# EAGLE design receiver (EAGLE 6.4)
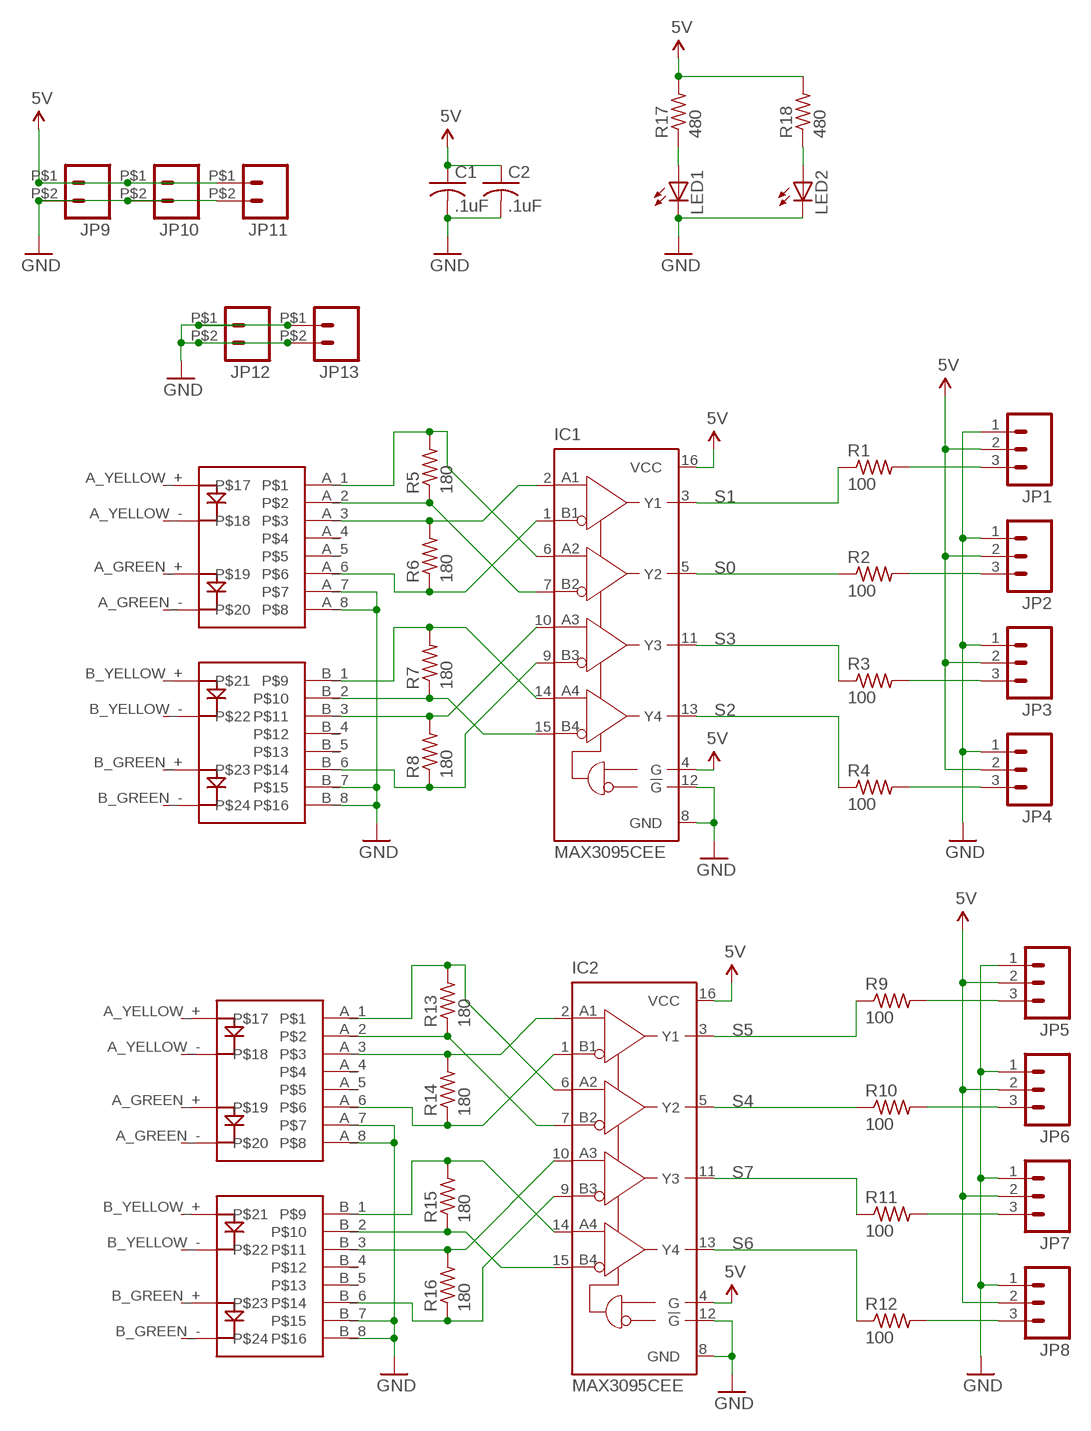
[diagram p0: schematic, sheet 1]

## Parts
C1  .1uF  C-USC0603  [C0603]
C2  .1uF  C-USC0603  [C0603]
IC1  MAX3095CEE  [QSOP16]
IC2  MAX3095CEE  [QSOP16]
JP1  M03-SCREW-5MM  [SCREWTERMINAL-5MM-3]
JP2  M03-SCREW-5MM  [SCREWTERMINAL-5MM-3]
JP3  M03-SCREW-5MM  [SCREWTERMINAL-5MM-3]
JP4  M03-SCREW-5MM  [SCREWTERMINAL-5MM-3]
JP5  M03-SCREW-5MM  [SCREWTERMINAL-5MM-3]
JP6  M03-SCREW-5MM  [SCREWTERMINAL-5MM-3]
JP7  M03-SCREW-5MM  [SCREWTERMINAL-5MM-3]
JP8  M03-SCREW-5MM  [SCREWTERMINAL-5MM-3]
JP9  M026.35MM  [SCREWTERMINAL-6.35MM-2]
JP10  M026.35MM  [SCREWTERMINAL-6.35MM-2]
JP11  M026.35MM  [SCREWTERMINAL-6.35MM-2]
JP12  M026.35MM  [SCREWTERMINAL-6.35MM-2]
JP13  M026.35MM  [SCREWTERMINAL-6.35MM-2]
LED1  LEDCHIPLED_0805  [CHIPLED_0805]
LED2  LEDCHIPLED_0805  [CHIPLED_0805]
R1  100  R-US_R0603  [R0603]
R2  100  R-US_R0603  [R0603]
R3  100  R-US_R0603  [R0603]
R4  100  R-US_R0603  [R0603]
R5  180  R-US_R0603  [R0603]
R6  180  R-US_R0603  [R0603]
R7  180  R-US_R0603  [R0603]
R8  180  R-US_R0603  [R0603]
R9  100  R-US_R0603  [R0603]
R10  100  R-US_R0603  [R0603]
R11  100  R-US_R0603  [R0603]
R12  100  R-US_R0603  [R0603]
R13  180  R-US_R0603  [R0603]
R14  180  R-US_R0603  [R0603]
R15  180  R-US_R0603  [R0603]
R16  180  R-US_R0603  [R0603]
R17  480  R-US_R0603  [R0603]
R18  480  R-US_R0603  [R0603]
U$1  RJ45_2X1  [RJ45_2X1]
U$2  RJ45_2X1  [RJ45_2X1]

## Nets
5V: C1.1 C2.1 IC1.4(G) IC1.16(VCC) IC2.4(G) IC2.16(VCC) JP1.2 JP2.2 JP3.2 JP4.2 JP5.2 JP6.2 JP7.2 JP8.2 JP9.P$1 JP10.P$1 JP11.P$1 R17.2 R18.2
GND: C1.2 C2.2 IC1.8(GND) IC1.12(!G) IC2.8(GND) IC2.12(!G) JP1.1 JP2.1 JP3.1 JP4.1 JP5.1 JP6.1 JP7.1 JP8.1 JP9.P$2 JP10.P$2 JP11.P$2 JP12.P$1 JP12.P$2 JP13.P$1 JP13.P$2 LED1.C LED2.C U$1.A_7 U$1.A_8 U$1.B_7 U$1.B_8 U$2.A_7 U$2.A_8 U$2.B_7 U$2.B_8
N$1: JP1.3 R1.2
N$2: IC1.6(A2) R5.2 U$1.A_1
N$3: IC1.7(B2) R5.1 U$1.A_2
N$4: JP2.3 R2.2
N$5: JP3.3 R3.2
N$6: JP4.3 R4.2
N$7: IC2.6(A2) R13.2 U$2.A_1
N$8: IC1.2(A1) R6.2 U$1.A_3
N$9: IC1.1(B1) R6.1 U$1.A_6
N$10: IC1.14(A4) R7.2 U$1.B_1
N$11: IC1.15(B4) R7.1 U$1.B_2
N$12: IC1.10(A3) R8.2 U$1.B_3
N$13: IC1.9(B3) R8.1 U$1.B_6
N$14: IC2.7(B2) R13.1 U$2.A_2
N$15: IC2.2(A1) R14.2 U$2.A_3
N$16: IC2.1(B1) R14.1 U$2.A_6
N$17: IC2.14(A4) R15.2 U$2.B_1
N$18: IC2.15(B4) R15.1 U$2.B_2
N$19: IC2.10(A3) R16.2 U$2.B_3
N$20: IC2.9(B3) R16.1 U$2.B_6
N$21: JP5.3 R9.2
N$22: JP6.3 R10.2
N$23: JP7.3 R11.2
N$24: JP8.3 R12.2
N$25: LED2.A R18.1
N$27: LED1.A R17.1
S0: IC1.5(Y2) R2.1
S1: IC1.3(Y1) R1.1
S2: IC1.13(Y4) R4.1
S3: IC1.11(Y3) R3.1
S4: IC2.5(Y2) R10.1
S5: IC2.3(Y1) R9.1
S6: IC2.13(Y4) R12.1
S7: IC2.11(Y3) R11.1
Unconnected: U$1.A_4 U$1.A_5 U$1.A_GREEN_+ U$1.A_GREEN_- U$1.A_YELLOW_+ U$1.A_YELLOW_- U$1.B_4 U$1.B_5 U$1.B_GREEN_+ U$1.B_GREEN_- U$1.B_YELLOW_+ U$1.B_YELLOW_- U$2.A_4 U$2.A_5 U$2.A_GREEN_+ U$2.A_GREEN_- U$2.A_YELLOW_+ U$2.A_YELLOW_- U$2.B_4 U$2.B_5 U$2.B_GREEN_+ U$2.B_GREEN_- U$2.B_YELLOW_+ U$2.B_YELLOW_-

## Library data of the parts
C1 C2 = adafruit:C-US: CAPACITOR, American symbol
IC1 IC2 = LEDscape:MAX309*: ±15kV ESD-Protected, 10Mbps, 3V/5V, Quad RS-422/RS-485 Receivers Source: http://pdfserv.maxim-ic.com/en/ds/MAX3095-MAX3096.pdf; MPN: MAX3095CEE+; OC_FARNELL: unknown; OC_NEWARK: 67K4748
JP1-JP8 = SparkFun-Connectors:M03: Header 3 Standard 3-pin 0.1" header. Use with straight break away headers (SKU : PRT-00116), right angle break away headers (PRT-00553), swiss pins (PRT-00743), machine pins (PRT-00117), and female headers (PRT-00115). Molex polarized connector foot print use with SKU : PRT-08232 with associated crimp pins and housings.
JP9-JP13 = SparkFun:M02: Header 2 Standard 2-pin 0.1" header. Use with straight break away headers (SKU : PRT-00116), right angle break away headers (PRT-00553), swiss pins (PRT-00743), machine pins (PRT-00117), and female headers (PRT-00115). Molex polarized connector foot print use with SKU : PRT-08233 with associated crimp pins and housings.
LED1 LED2 = adafruit:LED: LED OSRAM: - CHIPLED LG R971, LG N971, LY N971, LG Q971, LY Q971, LO R971, LY R971 LH N974, LH R974 LS Q976, LO Q976, LY Q976 LO Q996 - Hyper CHIPLED LW Q18S LB Q993, LB Q99A, LB R99A - SideLED LS A670, LO A670, LY A670, LG A670, LP A670 LB A673, LV A673, LT A673, LW A673 LH A674 LY A675 LS A676, LA A676, LO A676, LY A676, LW A676 LS A679, LY A679, LG A679 - Hyper Micro SIDELED® LS Y876, LA Y876, LO Y876, LY Y876 LT Y87S - SmartLED LW L88C, LW L88S LB L89C, LB L89S, LG L890 LS L89K, LO L89K, LY L89K LS L896, LA L896, LO L896, LY L896 - TOPLED LS T670, LO T670, LY T670, LG T670, LP T670 LSG T670, LSP T670, LSY T670, LOP T670, LYG T670 LG T671, LOG T671, LSG T671 LB T673, LV T673, LT T673, LW T673 LH T674 LS T676, LA T676, LO T676, LY T676, LB T676, LH T676, LSB T676, LW T676 LB T67C, LV T67C, LT T67C, LS T67K, LO T67K, LY T67K, LW E67C LS E67B, LA E67B, LO E67B, LY E67B, LB E67C, LV E67C, LT E67C LW T67C LS T679, LY T679, LG T679 LS T770, LO T770, LY T770, LG T770, LP T770 LB T773, LV T773, LT T773, LW T773 LH T774 LS E675, LA E675, LY E675, LS T675 LS T776, LA T776, LO T776, LY T776, LB T776 LHGB T686 LT T68C, LB T68C - Hyper Mini TOPLED® LB M676 - Mini TOPLED Santana® LG M470 LS M47K, LO M47K, LY M47K Source: http://www.osram.convergy.de/
R1-R18 = adafruit:R-US_: RESISTOR, American symbol
U$1 U$2 = LEDscape:RJ45_2X1

## Board
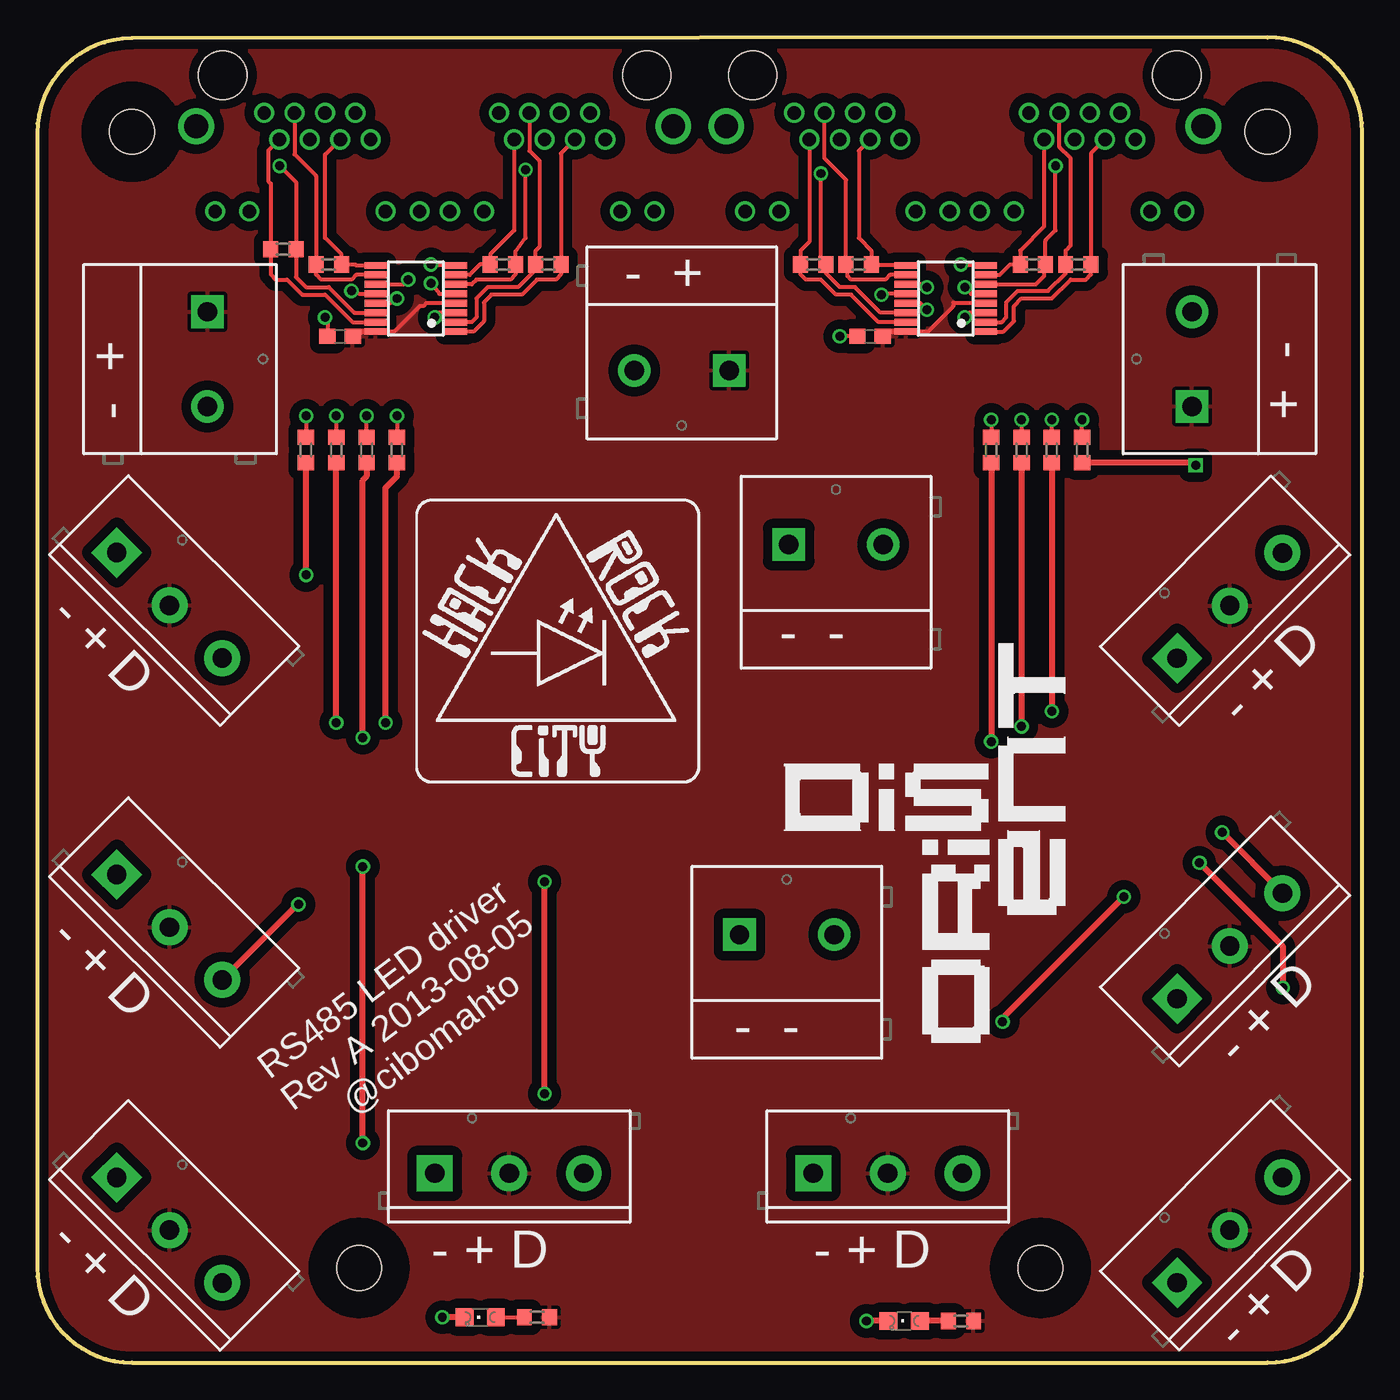
[diagram p1: board, top side]
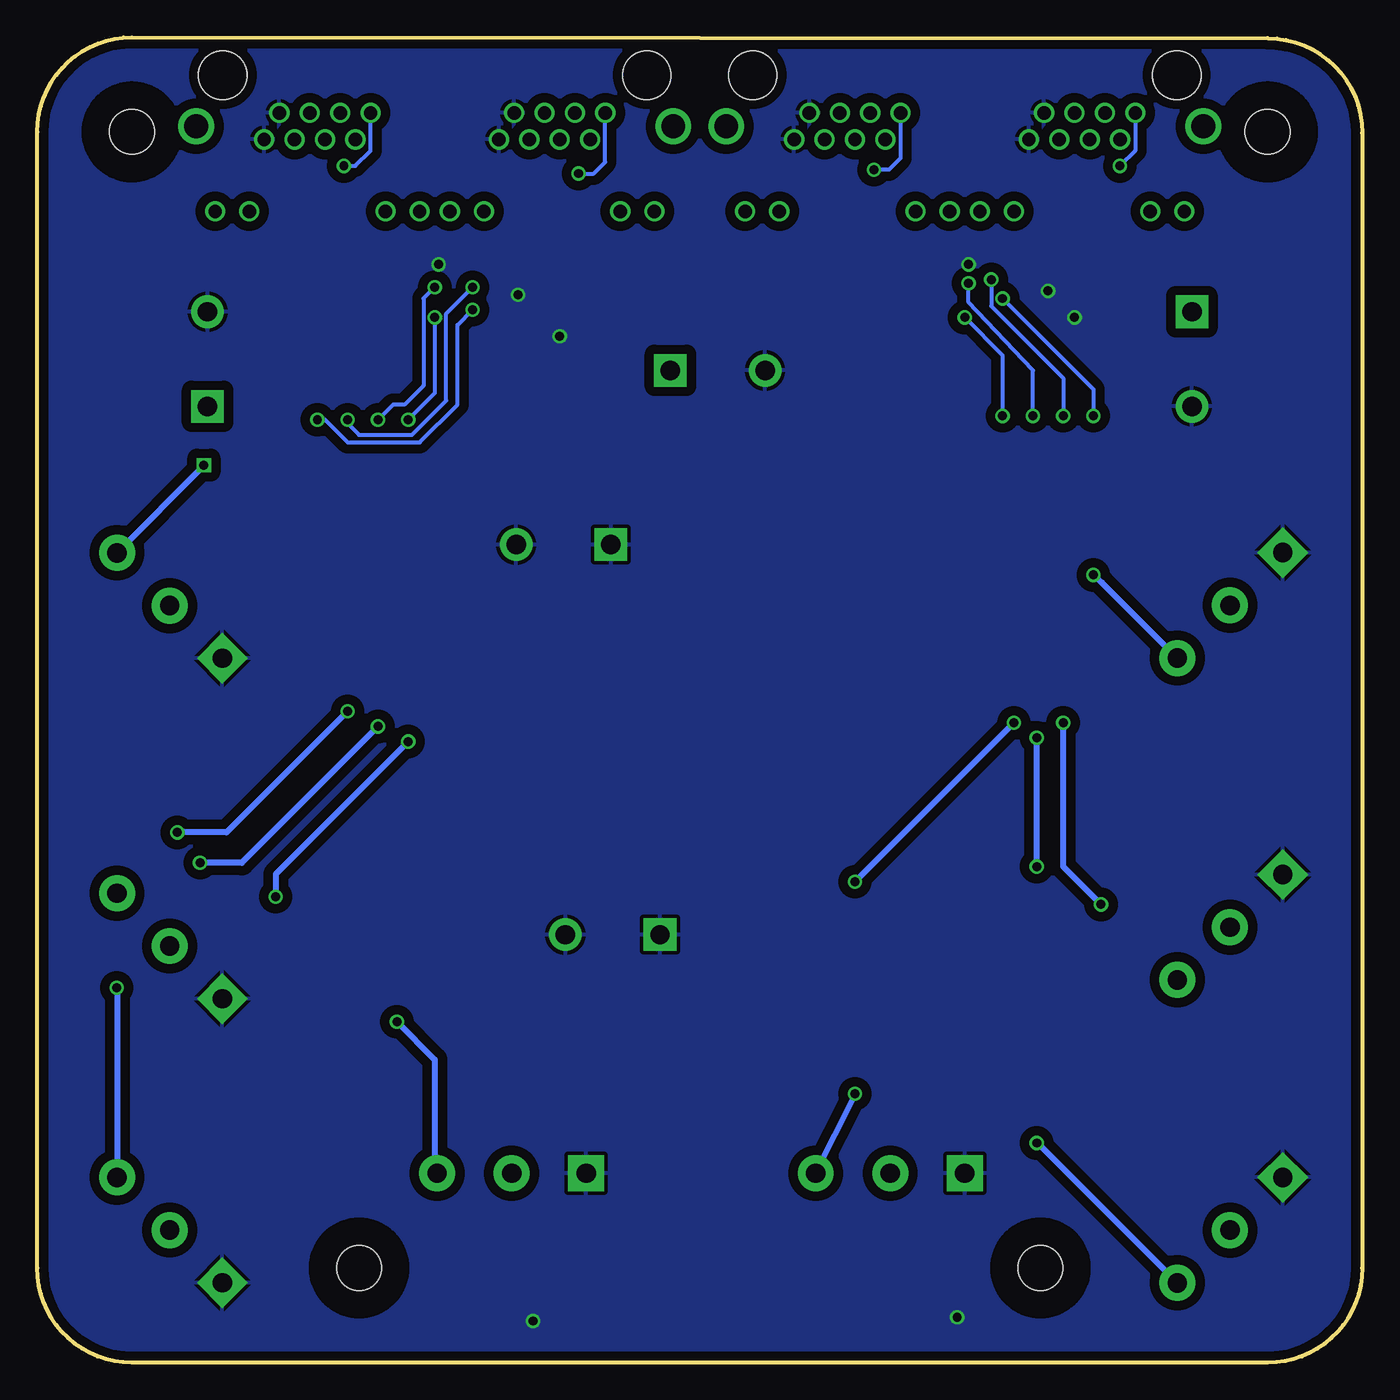
[diagram p2: board, bottom side, seen from below]

Size 88.9 x 88.89 mm. Coordinates in mm from the lower left corner, seen from the top.
Outline: 82.55,88.89 6.34,88.83 arc90 0,82.48 0,6.35 arc90 6.35,0 82.55,0 arc90 88.9,6.35 88.9,82.55 arc90 82.55,88.89
Copper layers (1*16): Top 0.0356mm / dielectric 1.5011mm / Bottom 0.0356mm
Design rules "LaenPCBOrder": minimum track width 6mil, minimum drill 13mil, track to track 6mil, track to pad 6mil, pad to pad 6mil, via to via 6mil, smd to smd 6mil, copper to edge 15mil, drill to drill 6mil, minimum pad ring 7mil, minimum via ring 7mil, stop-mask expansion 4mil, vias tented up to drill 0mil, thermal gap 10mil
Holes 3 mm at 6.35,82.55 21.59,6.35 67.31,6.35 82.55,82.55
tRestrict: area 3.8,80 to 8.9,85.1; area 80,80 to 85.1,85.1; area 64.8,3.8 to 69.8,8.9; area 19.1,3.8 to 24.1,8.9
bRestrict: area 19.1,3.8 to 24.1,8.9; area 64.8,3.8 to 69.8,8.9; area 80,80 to 85.1,85.1; area 3.8,80 to 8.9,85.1

### Footprints (pad centres in the part's own frame; a part is rotated, then mirrored left to right if it is on the bottom)
C0603 = smd 1.1 x 1: 1 -0.85,0; 2 0.85,0
QSOP16 = smd 0.45 x 1.5: 1 -2.223,-2.69; 2 -1.587,-2.69; 3 -0.953,-2.69; 4 -0.318,-2.69; 5 0.318,-2.69; 6 0.953,-2.69; 7 1.587,-2.69; 8 2.223,-2.69; 9 2.223,2.69; 10 1.587,2.69; 11 0.953,2.69; 12 0.318,2.69; 13 -0.318,2.69; 14 -0.953,2.69; 15 -1.587,2.69; 16 -2.223,2.69
SCREWTERMINAL-5MM-3 = drill 1.3 pad 2.413 square: 1 0,0 | drill 1.3 pad 2.413: 2 5,0; 3 10,0
SCREWTERMINAL-6.35MM-2 = drill 1.3 pad 2.184 square: P$1 -3.175,0 | drill 1.3 pad 2.184: P$2 3.175,0
CHIPLED_0805 = smd 1.2 x 1.2: A 0,-1.05; C 0,1.05
R0603 = smd 1 x 1.1: 1 -0.85,0; 2 0.85,0
RJ45_2X1 = drill 0.9: A_1 -4.305,2.54; A_2 -5.325,4.32; A_3 -6.345,2.54; A_4 -7.365,4.32; A_5 -8.385,2.54; A_6 -9.405,4.32; A_7 -10.425,2.54; A_8 -11.445,4.32; A_GREEN_+ -3.305,9.14; A_GREEN_- -1.015,9.14; A_YELLOW_+ -14.735,9.14; A_YELLOW_- -12.445,9.14; B_1 11.445,2.54; B_2 10.425,4.32; B_3 9.405,2.54; B_4 8.385,4.32; B_5 7.365,2.54; B_6 6.345,4.32; B_7 5.325,2.54; B_8 4.305,4.32; B_GREEN_+ 12.445,9.14; B_GREEN_- 14.735,9.14; B_YELLOW_+ 1.015,9.14; B_YELLOW_- 3.305,9.14 | drill 1.6: P$3 -16,3.43; P$6 16,3.43 | hole 3.25: -14.225,0; 14.225,0

### Placement (x,y rotation side)
C1  20.32,68.83 180 top
C2  55.88,68.83 180 top
IC1  25.4,71.37 90 top
IC2  60.96,71.37 90 top
JP1  26.67,12.7 0 top
JP2  5.33,12.42 315 top
JP3  5.33,32.74 315 top
JP4  5.33,54.33 315 top
JP5  52.07,12.7 0 top
JP6  76.48,5.36 45 top
JP7  76.48,24.41 45 top
JP8  76.48,47.24 45 top
JP9  77.47,67.31 90 top
JP10  43.24,66.55 180 top
JP11  11.43,67.31 270 top
JP12  53.59,54.86 0 top
JP13  50.29,28.7 0 top
LED1  29.72,3.05 90 top
LED2  58.17,2.79 90 top
R1  24.13,61.21 270 top
R2  22.1,61.21 270 top
R3  20.07,61.21 270 top
R4  18.03,61.21 270 top
R5  31.24,73.66 0 top
R6  34.29,73.66 180 top
R7  16.51,74.68 0 top
R8  19.56,73.66 180 top
R9  64.01,61.21 270 top
R10  66.04,61.21 270 top
R11  68.07,61.21 270 top
R12  70.1,61.21 270 top
R13  66.8,73.66 0 top
R14  69.85,73.66 180 top
R15  52.07,73.66 0 top
R16  55.12,73.66 180 top
R17  33.53,3.05 0 top
R18  61.98,2.79 0 top
U$1  26.67,86.36 180 top
U$2  62.23,86.36 180 top
U$3  [DISORIENT_LOGO]  61.47,35.31 0 top
U$4  [HRC_LOGO_0.75IN]  25.4,38.86 0 top

### Tracks (layer width: path | path; a pad name or v marks a point on that pad's centre or on a via)
5V
  Top 0.254: IC1.4 26.1,71.06 25.91,70.87 25.65,70.87 23.94,69.15 IC1.16 | IC2.4 61.53,71.06 61.47,71.12 61.47,70.87 59.69,69.09 59.63,69.15 IC2.16
  Top 0.406: IC1.16 21.49,69.15 C1.1 | IC2.16 57.05,69.15 C2.1
  pour Top (isolate 0.635): 0,0 0,88.9 88.9,88.9 88.9,0
GND  (via drill 0.6)
  Top 0.254: IC1.8 26.61,73.6 v26.42,73.66 | v21.08,71.88 21.65,71.69 IC1.12 | IC2.12 56.71,71.69 v56.64,71.63 | IC2.8 62.04,73.6 v61.98,73.66 | C2.2 v53.85,68.83 | v19.3,70.1 19.47,69.94 C1.2
  Top 0.406: LED2.C v55.63,2.79 | LED1.C v27.18,3.05
  pour Bottom (isolate 0.635): 0,0 0,88.9 88.9,88.9 88.9,0
N$1  (via drill 0.6)
  Top 0.406: v34.04,18.03 v34.04,32.26 | v23.37,42.93 23.37,58.67 24.13,59.44 R1.2
  Bottom 0.406: JP1.3 34.04,17.93 v34.04,18.03 | v34.04,32.26 v23.37,42.93
N$2  (via drill 0.6)
  Top 0.254: IC1.6 29.15,72.33 29.46,72.64 31.75,72.64 32.09,72.99 R5.2 32.09,74.51 32.77,75.44 v32.77,80.01
  Bottom 0.254: U$1.A_1 30.98,80.78 31.75,80.01 v32.77,80.01
N$3
  Top 0.254: IC1.7 29.02,72.96 29.72,73.66 R5.1 30.39,74.33 32,75.94 U$1.A_2
N$4  (via drill 0.6)
  Top 0.406: v21.84,14.73 v21.84,33.27 | v21.84,41.91 21.84,59.18 22.1,59.44 R2.2
  Bottom 0.406: JP2.3 21.79,14.73 v21.84,14.73 | v21.84,33.27 v21.84,41.91
N$5  (via drill 0.6)
  Top 0.406: v20.07,42.93 R3.2 | JP3.3 17.47,30.73 v17.53,30.73
  Bottom 0.406: v17.53,30.73 20.07,33.27 v20.07,42.93
N$6  (via drill 0.6)
  Top 0.406: v18.03,52.83 R4.2
  Bottom 0.406: JP4.3 17.47,52.32 v18.03,52.83
N$7  (via drill 0.6)
  Top 0.254: IC2.6 66.99,72.33 67.56,72.9 67.56,73.57 R13.2 67.65,75.27 68.33,75.95 v68.33,80.26
  Bottom 0.254: v68.33,80.26 67.56,80.26 66.55,81.28 66.55,83.81 U$2.A_1
N$8
  Top 0.254: U$1.A_3 33.02,81.28 33.69,80.61 33.69,74.84 33.44,74.59 R6.2 33.44,73.32 32.26,72.14 30.23,72.14 29.46,71.37 29.46,70.1 29.15,69.79 IC1.2
N$9
  Top 0.254: U$1.A_6 35.14,81.11 R6.1 35.14,72.99 34.8,72.64 33.53,72.64 32.51,71.63 30.48,71.63 29.97,71.12 29.97,69.85 29.27,69.15 IC1.1
N$10  (via drill 0.6)
  Top 0.254: v16.26,80.26 17.36,79.16 R7.2 17.36,72.81 18.03,72.14 19.56,72.14 21.27,70.42 IC1.14
  Bottom 0.254: U$1.B_1 15.22,81.3 v16.26,80.26
N$11
  Top 0.254: U$1.B_2 15.49,81.29 15.49,79.25 15.66,79.08 R7.1 15.66,72.99 16,72.64 16.76,72.64 17.78,71.63 19.3,71.63 21.14,69.79 IC1.15
N$12
  Top 0.254: U$1.B_3 17.27,81.03 18.71,79.59 R8.2 18.71,72.99 19.05,72.64 21.08,72.64 21.4,72.96 IC1.10
N$13
  Top 0.254: U$1.B_6 19.3,81.02 19.3,75.44 20.41,74.33 R8.1 21.34,73.66 21.4,73.6 IC1.9
N$14
  Top 0.254: U$2.A_2 67.56,76.19 65.95,74.59 R13.1 65.28,73.66 64.58,72.96 IC2.7
N$15
  Top 0.254: U$2.A_3 68.58,81.53 69.34,80.77 69.34,74.93 69,74.59 R14.2 69,73.06 67.82,71.88 65.79,71.88 65.02,71.12 65.02,70.1 64.71,69.79 IC2.2
N$16
  Top 0.254: U$2.A_6 70.7,81.11 R14.1 70.7,72.99 70.36,72.64 69.34,72.64 68.07,71.37 66.04,71.37 65.53,70.87 65.53,69.85 64.83,69.15 IC2.1
N$17  (via drill 0.6)
  Top 0.254: v52.58,79.76 52.58,74 R15.2 52.92,73.06 53.85,72.14 54.86,72.14 56.58,70.42 IC2.14
  Bottom 0.254: v52.58,79.76 51.56,79.76 50.8,80.52 50.8,83.81 U$2.B_1
N$18
  Top 0.254: U$2.B_2 51.8,75.17 51.22,74.59 R15.1 51.22,72.99 51.56,72.64 52.58,72.64 53.59,71.63 54.61,71.63 56.45,69.79 IC2.15
N$19
  Top 0.254: U$2.B_3 52.83,83.81 52.83,80.77 54.27,79.34 R16.2 54.36,73.57 54.36,72.9 54.61,72.64 56.9,72.64 57.21,72.96 IC2.10
N$20
  Top 0.254: U$2.B_6 55.12,81.27 55.12,75.44 55.97,74.59 R16.1 56.03,73.6 IC2.9
N$21  (via drill 0.6)
  Top 0.406: R9.2 v64.01,41.66 | v72.9,31.24 64.77,23.11 v64.77,22.86
  Bottom 0.406: v64.01,41.66 72.9,32.77 v72.9,31.24 | v64.77,22.86 62.23,20.32 62.23,13.21 JP5.3
N$22  (via drill 0.6)
  Top 0.406: R10.2 v66.04,42.67 | v77.98,33.53 83.57,27.94 v83.57,25.15
  Bottom 0.406: v66.04,42.67 75.18,33.53 v77.98,33.53 | v83.57,25.15 83.55,25.13 JP6.3
N$23  (via drill 0.6)
  Top 0.406: R11.2 v68.07,43.69 | v79.5,35.56 83.55,31.51 JP7.3
  Bottom 0.406: v68.07,43.69 76.2,35.56 v79.5,35.56
N$24  (via drill 0.6)
  Top 0.406: v77.72,60.2 77.56,60.36 R12.2
  Bottom 0.406: JP8.3 77.72,60.14 v77.72,60.2
N$25
  Top 0.406: R18.1 LED2.A
N$27
  Top 0.254: LED1.A R17.1
S0  (via drill 0.6)
  Top 0.254: R2.1 v22.1,63.5 | v26.42,72.39 26.99,71.69 IC1.5
  Bottom 0.254: v22.1,63.5 22.1,66.55 26.42,71.12 v26.42,72.39
S1  (via drill 0.6)
  Top 0.254: IC1.3 26.99,70.42 v26.67,70.1 | v24.13,63.5 R1.1
  Bottom 0.254: v26.67,70.1 24.13,67.56 v24.13,63.5
S2  (via drill 0.6)
  Top 0.254: IC1.13 23.69,71.06 v24.13,71.37 | v18.03,63.5 R4.1
  Bottom 0.254: v24.13,71.37 18.03,65.28 v18.03,63.5
S3  (via drill 0.6)
  Top 0.254: IC1.11 24.57,72.33 v24.89,72.64 | v20.07,63.5 R3.1
  Bottom 0.254: v24.89,72.64 24.89,70.87 20.07,66.04 v20.07,63.5
S4  (via drill 0.6)
  Top 0.254: IC2.5 62.67,71.69 v62.23,72.14 | v66.04,63.25 R10.1
  Bottom 0.254: v62.23,72.14 62.99,71.37 62.99,65.53 64.26,64.26 65.02,64.26 v66.04,63.25
S5  (via drill 0.6)
  Top 0.254: IC2.3 62.55,70.42 v62.23,70.1 | v64.01,63.25 R9.1
  Bottom 0.254: v62.23,70.1 62.23,65.02 v64.01,63.25
S6  (via drill 0.6)
  Top 0.254: R12.1 v70.1,63.25 | v59.69,70.61 59.24,71.06 IC2.13
  Bottom 0.254: v70.1,63.25 69.6,63.25 68.07,61.72 63.25,61.72 60.71,64.26 60.71,69.6 v59.69,70.61
S7  (via drill 0.6)
  Top 0.254: R11.1 v68.07,63.25 | v59.69,72.14 59.5,72.33 IC2.11
  Bottom 0.254: v68.07,63.25 68.07,62.99 67.31,62.23 63.75,62.23 61.47,64.52 61.47,70.36 v59.69,72.14

### Text on the board
tNames: - + | - + | + - | - + D | - - | - + D | - + D | RS485 LED driver / Rev A 2013-08-05 / @cibomahto | - - | - + D | - + D | - + D | - + D | - + D